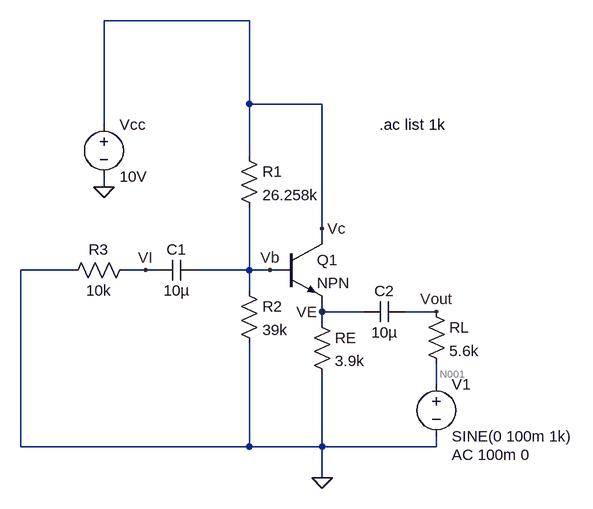
[diagram p0: schematic Common_Emitter_Rout_Value.asc]
Common_Emitter_Rout_Value.asc, the LTspice schematic file:
Version 4
SHEET 1 880 680
WIRE 208 -176 -16 -176
WIRE 208 -48 208 -176
WIRE 320 -48 208 -48
WIRE -16 -16 -16 -176
WIRE 208 32 208 -48
WIRE -16 80 -16 64
WIRE 320 144 320 -48
WIRE 320 160 320 144
WIRE -64 208 -144 208
WIRE 48 208 16 208
WIRE 64 208 48 208
WIRE 208 208 208 112
WIRE 208 208 128 208
WIRE 240 208 208 208
WIRE 256 208 240 208
WIRE 208 240 208 208
WIRE 320 272 320 256
WIRE 384 272 320 272
WIRE 496 272 448 272
WIRE 320 288 320 272
WIRE 496 384 496 352
WIRE -144 480 -144 208
WIRE 208 480 208 320
WIRE 208 480 -144 480
WIRE 320 480 320 368
WIRE 320 480 208 480
WIRE 496 480 496 464
WIRE 496 480 320 480
WIRE 320 528 320 480
FLAG -16 80 0
FLAG 320 272 VE
FLAG 320 144 Vc
FLAG 320 528 0
FLAG 496 272 Vout
FLAG 48 208 VI
FLAG 240 208 Vb
SYMBOL voltage -16 -32 R0
WINDOW 123 0 0 Left 0
WINDOW 39 0 0 Left 0
SYMATTR InstName Vcc
SYMATTR Value 10V
SYMBOL res 192 16 R0
WINDOW 0 36 40 Left 2
WINDOW 3 36 76 Left 2
SYMATTR InstName R1
SYMATTR Value 26.258k
SYMBOL res 192 224 R0
WINDOW 0 36 40 Left 2
WINDOW 3 36 76 Left 2
SYMATTR InstName R2
SYMATTR Value 39k
SYMBOL res 304 272 R0
WINDOW 0 36 40 Left 2
WINDOW 3 36 76 Left 2
SYMATTR InstName RE
SYMATTR Value 3.9k
SYMBOL res 480 256 R0
WINDOW 0 36 40 Left 2
WINDOW 3 36 76 Left 2
SYMATTR InstName RL
SYMATTR Value 5.6k
SYMBOL voltage 496 368 R0
WINDOW 123 24 124 Left 2
WINDOW 39 0 0 Left 0
SYMATTR InstName V1
SYMATTR Value SINE(0 100m 1k)
SYMATTR Value2 AC 100m 0
SYMBOL res 32 192 R90
WINDOW 0 0 56 VBottom 2
WINDOW 3 32 56 VTop 2
SYMATTR InstName R3
SYMATTR Value 10k
SYMBOL cap 128 192 R90
WINDOW 0 0 32 VBottom 2
WINDOW 3 32 32 VTop 2
SYMATTR InstName C1
SYMATTR Value 10µ
SYMBOL cap 448 256 R90
WINDOW 0 0 32 VBottom 2
WINDOW 3 32 32 VTop 2
SYMATTR InstName C2
SYMATTR Value 10µ
SYMBOL npn 256 160 R0
WINDOW 0 56 32 Left 2
WINDOW 3 56 68 Left 2
SYMATTR InstName Q1
TEXT 408 -16 Left 2 !.ac list 1k

The netlist it stands for:
* Common_Emitter_Rout_Value.asc
Vcc Vc 0 10V
R1 Vc Vb 26.258k
R2 Vb 0 39k
RE VE 0 3.9k
RL Vout N001 5.6k
V1 N001 0 SINE(0 100m 1k) AC 100m 0
R3 VI 0 10k
C1 Vb VI 10µ
C2 Vout VE 10µ
Q1 Vc Vb VE 0 NPN
.model NPN NPN
.model PNP PNP
.lib standard.bjt
.ac list 1k
.backanno
.end

* Results of the author's LTspice run, read from the files saved beside the schematic
* Operating Point, zero values left out:
*   V(vc) = 10 V
*   V(vb) = 5.777 V
*   V(ve) = 4.997 V
*   Ic(Q1) = 1.269 mA
*   Ib(Q1) = 12.69 µA
*   Ie(Q1) = -1.281 mA
*   I(Re) = 1.281 mA
*   I(R2) = 148.1 µA
*   I(R1) = 160.8 µA
*   I(Vcc) = -1.429 mA
* AC Analysis:
*   frequency = 1 k
*   V(vc) = 0 V
*   V(vb) = 1.043 mV
*   V(ve) = 1.392 mV
*   V(vout) = 1.392 mV
*   V(n001) = 100 mV
*   V(vi) = 1.043 mV
*   Ic(Q1) = -17.08 µA
*   Ib(Q1) = -170.8 nA
*   Ie(Q1) = 17.25 µA
*   I(C2) = 17.61 µA
*   I(C1) = 104.3 nA
*   I(R3) = 104.3 nA
*   I(Rl) = -17.61 µA
*   I(Re) = 356.8 nA
*   I(R2) = 26.75 nA
*   I(R1) = -39.73 nA
*   I(V1) = -17.61 µA
*   I(Vcc) = 17.12 µA